# Altium schematic sheet LCD TFT 40 Pin.SchDoc
size A; SheetNumber: 6; SheetTotal: 9
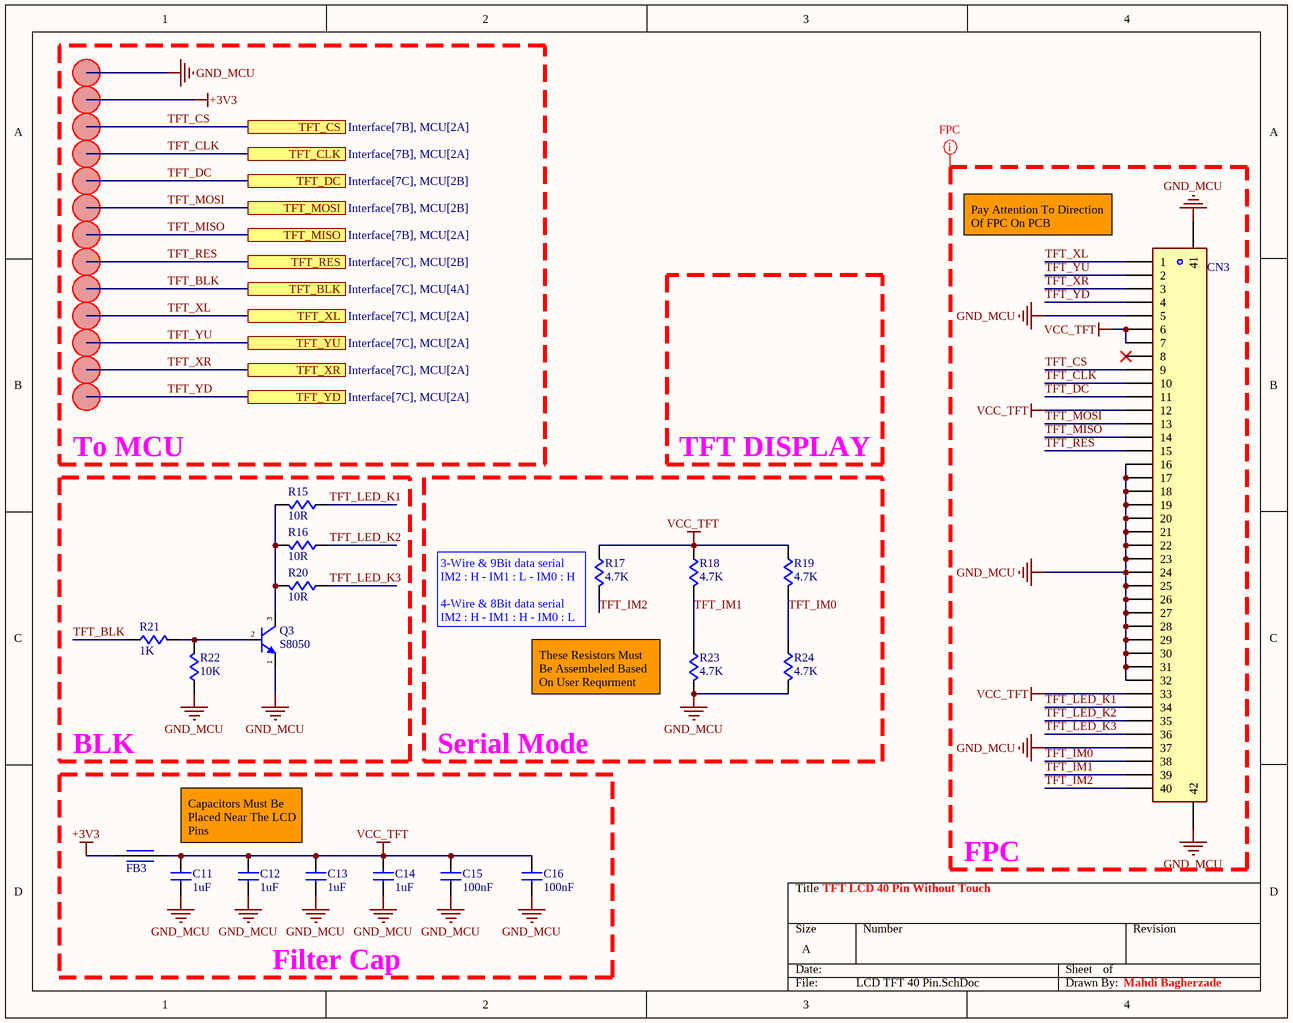
[diagram p0: LCD TFT 40 Pin.SchDoc]

## Parts
C11  value 1uF  [C-0805]  (hidden comment: CAP Cer 1uF-50V-X7R-SMD)
C12  value 1uF  [C-0805]  (hidden comment: CAP Cer 1uF-50V-X7R-SMD)
C13  value 1uF  [C-0805]  (hidden comment: CAP Cer 1uF-50V-X7R-SMD)
C14  value 1uF  [C-0805]  (hidden comment: CAP Cer 1uF-50V-X7R-SMD)
C15  value 100nF  [C-0805]  (hidden comment: CAP Cer 100nF-50V-X7R-SMD)
C16  value 100nF  [C-0805]  (hidden comment: CAP Cer 100nF-50V-X7R-SMD)
CN3  Connector FPC Right-2mm-40 Pin  [CN-FPC-40-0.5mm-hor]  (value not drawn)
FB3  Ferrite Bead SMD  [FB-0805]  (value not drawn)
Q3  value S8050  [SOT23-213]  (hidden comment: TR S8050-SMD)
R15  value 10R  [R-0805]  (hidden comment: RES 10R-5%-1/8W-SMD)
R16  value 10R  [R-0805]  (hidden comment: RES 10R-5%-1/8W-SMD)
R17  value 4.7K  [R-0805]  (hidden comment: RES 4.7K-5%-1/8W-SMD)
R18  value 4.7K  [R-0805]  (hidden comment: RES 4.7K-5%-1/8W-SMD)
R19  value 4.7K  [R-0805]  (hidden comment: RES 4.7K-5%-1/8W-SMD)
R20  value 10R  [R-0805]  (hidden comment: RES 10R-5%-1/8W-SMD)
R21  value 1K  [R-0805]  (hidden comment: RES 1K-5%-1/8W-SMD)
R22  value 10K  [R-0805]  (hidden comment: RES 10K-5%-1/8W-SMD)
R23  value 4.7K  [R-0805]  (hidden comment: RES 4.7K-5%-1/8W-SMD)
R24  value 4.7K  [R-0805]  (hidden comment: RES 4.7K-5%-1/8W-SMD)
TP1  (no value)  [TEST POINT-DIP]  (net tie, no BOM)
TP2  (no value)  [TEST POINT-DIP]  (net tie, no BOM)
TP3  (no value)  [TEST POINT-DIP]  (net tie, no BOM)
TP4  (no value)  [TEST POINT-DIP]  (net tie, no BOM)
TP5  (no value)  [TEST POINT-DIP]  (net tie, no BOM)
TP6  (no value)  [TEST POINT-DIP]  (net tie, no BOM)
TP7  (no value)  [TEST POINT-DIP]  (net tie, no BOM)
TP8  (no value)  [TEST POINT-DIP]  (net tie, no BOM)
TP9  (no value)  [TEST POINT-DIP]  (net tie, no BOM)
TP10  (no value)  [TEST POINT-DIP]  (net tie, no BOM)
TP11  (no value)  [TEST POINT-DIP]  (net tie, no BOM)
TP12  (no value)  [TEST POINT-DIP]  (net tie, no BOM)
TP13  (no value)  [TEST POINT-DIP]  (net tie, no BOM)

## Blocks framed on the sheet
To MCU: TP1-TP13

## Ports
TFT_BLK (see Interface[7C], MCU[4A]), TFT_CLK (see Interface[7B], MCU[2A]), TFT_CS (see Interface[7B], MCU[2A]), TFT_DC (see Interface[7C], MCU[2B]), TFT_MISO (see Interface[7B], MCU[2A]), TFT_MOSI (see Interface[7B], MCU[2B]), TFT_RES (see Interface[7C], MCU[2B]), TFT_XL (see Interface[7C], MCU[2A]), TFT_XR (see Interface[7C], MCU[2A]), TFT_YD (see Interface[7C], MCU[2A]), TFT_YU (see Interface[7C], MCU[2A])

## Nets
+3V3: FB3.1 TP2.1(TP)
GND_MCU: C11.1 C12.1 C13.1 C14.1 C15.1 C16.1 CN3.5 CN3.16 CN3.17 CN3.18 CN3.19 CN3.20 CN3.21 CN3.22 CN3.23 CN3.24 CN3.25 CN3.26 CN3.27 CN3.28 CN3.29 CN3.30 CN3.31 CN3.32 CN3.37 CN3.41 CN3.42 Q3.1(E) R22.1 R23.2 R24.2 TP1.1(TP)
VCC_TFT: C11.2 C12.2 C13.2 C14.2 C15.2 C16.2 CN3.6 CN3.7 CN3.12 CN3.33 FB3.2 R17.1 R18.1 R19.1
TFT_BLK: R21.1 TP9.1(TP) ; port TFT_BLK
TFT_CLK: CN3.10 TP4.1(TP) ; port TFT_CLK
TFT_CS: CN3.9 TP3.1(TP) ; port TFT_CS
TFT_DC: CN3.11 TP5.1(TP) ; port TFT_DC
TFT_IM0: CN3.38 R19.2 R24.1
TFT_IM1: CN3.39 R18.2 R23.1
TFT_IM2: CN3.40 R17.2
TFT_LED_K1: CN3.34 R15.1
TFT_LED_K2: CN3.35 R16.1
TFT_LED_K3: CN3.36 R20.1
TFT_MISO: CN3.14 TP7.1(TP) ; port TFT_MISO
TFT_MOSI: CN3.13 TP6.1(TP) ; port TFT_MOSI
TFT_RES: CN3.15 TP8.1(TP) ; port TFT_RES
TFT_XL: CN3.1 TP10.1(TP) ; port TFT_XL
TFT_XR: CN3.3 TP12.1(TP) ; port TFT_XR
TFT_YD: CN3.4 TP13.1(TP) ; port TFT_YD
TFT_YU: CN3.2 TP11.1(TP) ; port TFT_YU
NetQ3_2: Q3.2(B) R21.2 R22.2
NetQ3_3: Q3.3(C) R15.2 R16.2 R20.2

Not connected (* = marked no-connect by the designer): CN3 8*

## Layout directives
net class FPC: GND_MCU, TFT_CLK, TFT_CS, TFT_DC, TFT_IM0, TFT_IM1, TFT_IM2, TFT_LED_K1, TFT_LED_K2, TFT_LED_K3, TFT_MISO, TFT_MOSI, TFT_RES, TFT_XL, TFT_XR, TFT_YD, TFT_YU, VCC_TFT

## Notes on the sheet
- (near CN3) Pay Attention To Direction Of FPC On PCB
- TFT DISPLAY
- (near R17) 3-Wire & 9Bit data serial
  IM2 : H - IM1 : L - IM0 : H
  4-Wire & 8Bit data serial
  IM2 : H - IM1 : H - IM0 : L
- These Resistors Must Be Assembeled Based On User Requrment
- BLK
- Serial Mode
- Capacitors Must Be Placed Near The LCD Pins
- TFT LCD 40 Pin Without Touch
- FPC
- Filter Cap
- Mahdi Bagherzade

## Library data of the parts
C11-C16 = CAP-CER: CAPACITOR; Phone Number: 0915 8700 314; Voltage: 50V; Tolerance: X7R; Type: SMD; Publisher: Mahdi Bagherzadeh; ComponentLink1Description: Linkedin; ComponentLink1URL: https://ir.linkedin.com/in/mahdi-bagherzade; Published Date: 9-15-2024
CN3 = CN-FPC-40pin: CONNECTOR; Phone Number: 0915 8700 314; Publisher: Mahdi Bagherzadeh; ComponentLink1Description: Linkedin; ComponentLink1URL: https://ir.linkedin.com/in/mahdi-bagherzade; Published Date: 9-15-2024; Size: 2mm-40 Pin; Type: Right
FB3 = FERRITE BEAD: INDUCATOR; Phone Number: 0915 8700 314; Publisher: Mahdi Bagherzadeh; ComponentLink1Description: Linkedin; ComponentLink1URL: https://ir.linkedin.com/in/mahdi-bagherzade; Published Date: 9-15-2024; Type: SMD
Q3 = S8050: TRANSISTOR; Phone Number: 0915 8700 314; Code: J3Y; Type: SMD; Publisher: Mahdi Bagherzadeh; ComponentLink1Description: Linkedin; ComponentLink1URL: https://ir.linkedin.com/in/mahdi-bagherzade; Published Date: 9-15-2024
R15-R24 = RES: RESISTOR; Phone Number: 0915 8700 314; Power: 1/8W; Tolerance: 5%; Publisher: Mahdi Bagherzadeh; ComponentLink1Description: Linkedin; ComponentLink1URL: https://ir.linkedin.com/in/mahdi-bagherzade; Published Date: 9-15-2024; Type: SMD
TP1-TP13 = TEST PIONT: Phone Number: 0915 8700 314; Publisher: Mahdi Bagherzadeh; ComponentLink1Description: Linkedin; ComponentLink1URL: https://ir.linkedin.com/in/mahdi-bagherzade; Published Date: 9-15-2024